# EAGLE schematic SGC.0 (EAGLE 7.0.0)
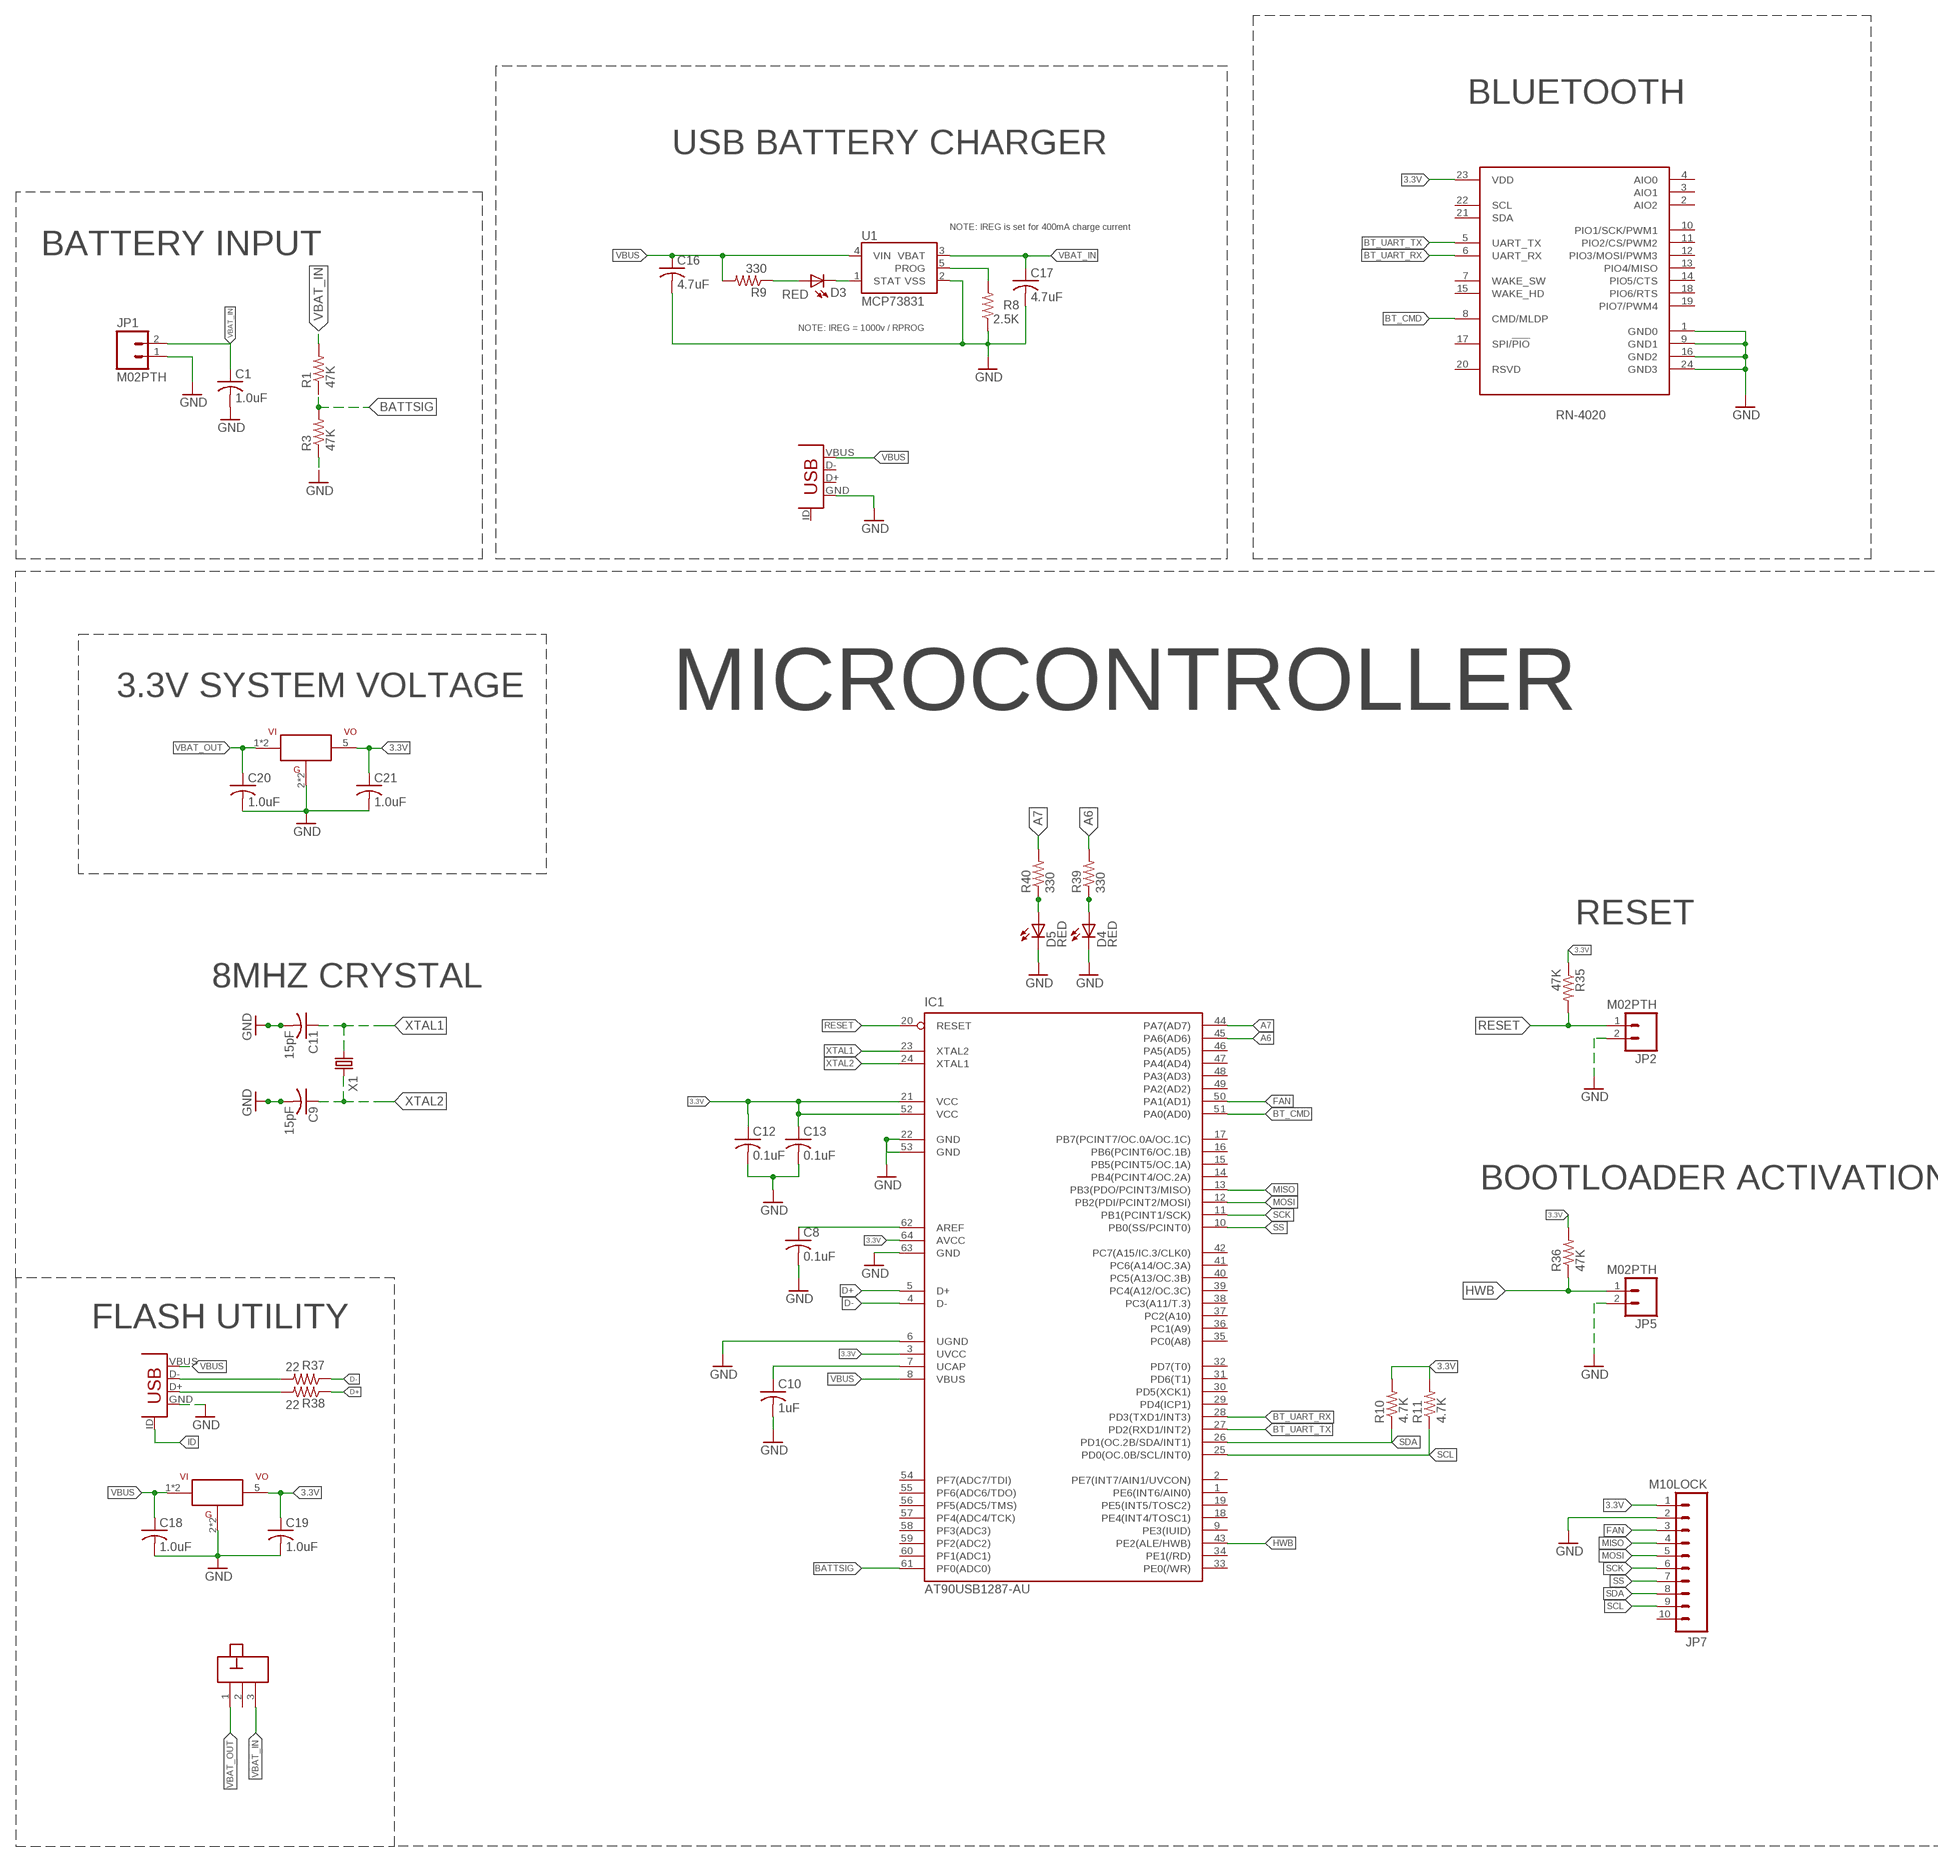
[diagram p0: schematic, sheet 1, part 1 of 2]
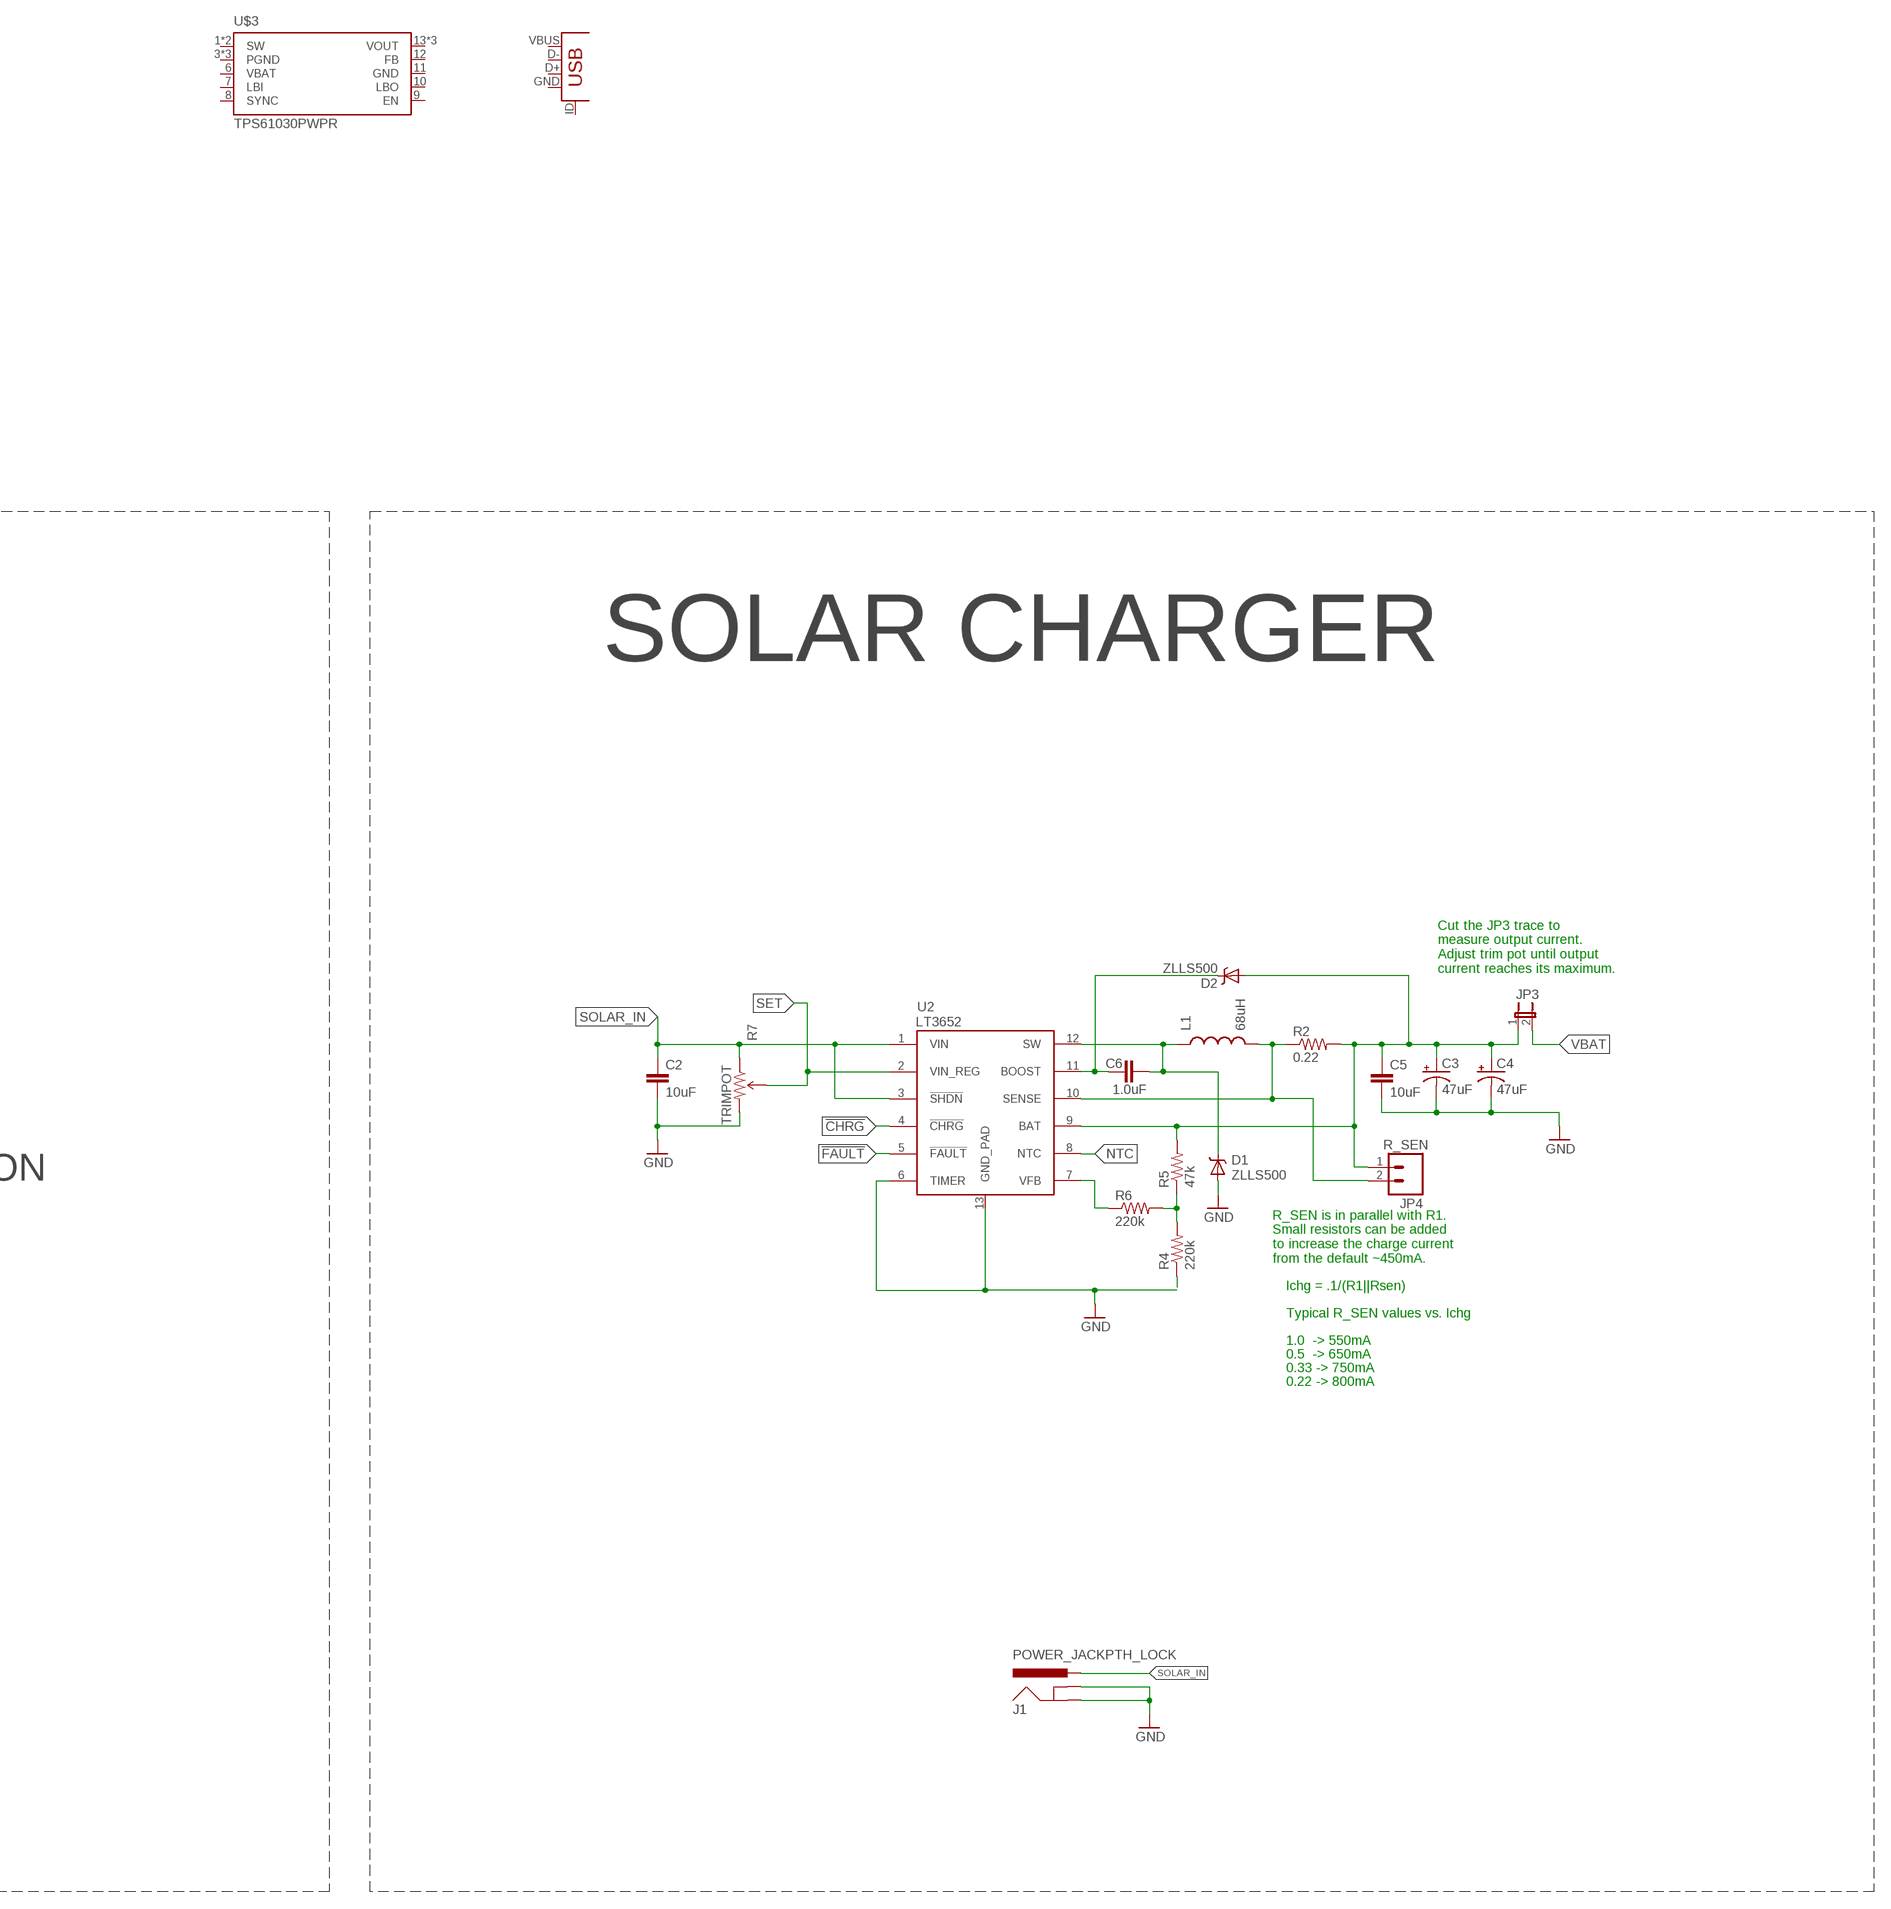
[diagram p1: schematic, sheet 1, part 2 of 2]

## Parts
C1  1.0uF  C-USC0603  [C0603]
C2  10uF  10UF50V20%(1210)  [1210]
C3  47uF  47UF-TANT  [EIA3528]
C4  47uF  47UF-TANT  [EIA3528]
C5  10uF  10UF-6.3V-20%(1206)  [1206]
C6  1.0uF  1.0UF-16V-10%(0603)  [0603-CAP]
C8  0.1uF  C-USC0603  [C0603]
C9  15pF  C-USC0603  [C0603]
C10  1uF  C-USC0603  [C0603]
C11  15pF  C-USC0603  [C0603]
C12  0.1uF  C-USC0603  [C0603]
C13  0.1uF  C-USC0603  [C0603]
C16  4.7uF  C-USC0603  [C0603]
C17  4.7uF  C-USC0603  [C0603]
C18  1.0uF  C-USC0603  [C0603]
C19  1.0uF  C-USC0603  [C0603]
C20  1.0uF  C-USC0603  [C0603]
C21  1.0uF  C-USC0603  [C0603]
D1  ZLLS500  ZLLS500ZLLS500  [SOT23]
D2  ZLLS500  ZLLS500ZLLS500  [SOT23]
D3  RED  LED0603  [LED-0603]
D4  RED  LED0603  [LED-0603]
D5  RED  LED0603  [LED-0603]
IC1  AT90USB1287-AU  [TQFP64]
J1  POWER_JACKPTH_LOCK  [POWER_JACK_PTH_LOCK]
JP1  M02PTH  [1X02]
JP2  M02PTH  [1X02]
JP3  JUMPER-PTH-2-NC  [PTH-JUMPER-NC_BOTTOM_NO_SILK]
JP4  R_SEN  M02PTH  [1X02]
JP5  M02PTH  [1X02]
JP7  M10LOCK  [1X10_LOCK]
L1  68uH  INDUCTOR68UH-1A  [CR75]
R1  47K  R-US_R0603  [R0603]
R2  0.22  0.22OHM1/4W1%(0805)  [0805]
R3  47K  R-US_R0603  [R0603]
R4  220k  220KOHM1/10W1%(0603)  [0603-RES]
R5  47k  47KOHM1/10W1%(0603)  [0603-RES]
R6  220k  220KOHM1/10W1%(0603)  [0603-RES]
R7  TRIMPOT  [TRIMPOT-5MM-V2]
R8  2.5K  R-US_R0603  [R0603]
R9  330  R-US_R0603  [R0603]
R10  4.7K  R-US_R0603  [R0603]
R11  4.7K  R-US_R0603  [R0603]
R35  47K  R-US_R0603  [R0603]
R36  47K  R-US_R0603  [R0603]
R37  22  R-US_R0603  [R0603]
R38  22  R-US_R0603  [R0603]
R39  330  R-US_R0603  [R0603]
R40  330  R-US_R0603  [R0603]
U1  MCP73831  [SOT23-5]
U2  LT3652  [MSOP-12_GND]
U$1  USB_MICRO_B_DX4  [USB_MICRO_B_DX4]
U$2  TPS73633-EP  [SOT23-5]
U$3  TPS61030PWPR  [TSSOP16]
U$4  TPS73633-EP  [SOT23-5]
U$5  USB_MICRO_B_DX4  [USB_MICRO_B_DX4]
U$6  RN4020  [RN4020]
U$7  SWITCH_SLIDE  [SWITCH_SLIDE]
U$8  USB_MICRO_B_DX4  [USB_MICRO_B_DX4]
X1  CRYSTALCTS406  [CTS406]

## Nets
3.3V: C12.1 C13.1 C19.1 C21.1 IC1.21(VCC) IC1.52(VCC) JP7.1 R10.2 R11.2 R35.1 R36.2 U$2.5 U$4.5 U$6.23(VDD)
!CHRG: U2.4(!CHRG)
!FAULT: U2.5(!FAULT)
A6: IC1.45(PA6(AD6)) R39.2
A7: IC1.44(PA7(AD7)) R40.2
BATTSIG: IC1.61(PF0(ADC0)) R1.1 R3.2
BOOST: C6.1 D2.3(C) U2.11(BOOST)
BT_CMD: IC1.51(PA0(AD0)) U$6.8(CMD/MLDP)
BT_UART_RX: IC1.28(PD3(TXD1/INT3)) U$6.6(UART_RX)
BT_UART_TX: IC1.27(PD2(RXD1/INT2)) U$6.5(UART_TX)
D+: IC1.5(D+) R37.1
D-: IC1.4(D-) R38.1
FAN: IC1.50(PA1(AD1)) JP7.3
FB: R4.2 R5.1 R6.2
GND: C1.2 C2.2 C3.C(-) C4.C(-) C5.2 C8.2 C9.2 C10.2 C11.2 C12.2 C13.2 C16.2 C17.2 C18.2 C19.2 C20.2 C21.2 D1.1(A) D4.C D5.C IC1.6(UGND) J1.GND J1.GNDBREAK JP1.1 JP2.2 JP5.2 JP7.2 R3.1 R4.1 R7.C(CW) R8.1 U1.2(VSS) U2.6(TIMER) U2.13(GND_PAD) U$1.GND U$2.2 U$2.4 U$4.2 U$4.4 U$5.GND U$6.1(GND0) U$6.9(GND1) U$6.16(GND2) U$6.24(GND3)
HWB: IC1.43(PE2(ALE/HWB)) JP5.1 R36.1
ID: U$1.ID
MISO: IC1.13(PB3(PDO/PCINT3/MISO)) JP7.4
MOSI: IC1.12(PB2(PDI/PCINT2/MOSI)) JP7.5
N$1: R37.2 U$1.D+
N$2: R38.2 U$1.D-
N$3: C10.1 IC1.7(UCAP)
N$4: R6.1 U2.7(VFB)
N$5: C3.A(+) C4.A(+) C5.1 D2.1(A) JP3.1 JP4.1 R2.2 R5.2 U2.9(BAT)
N$6: C8.1 IC1.62(AREF)
N$13: D3.A R9.1
N$14: D3.C U1.1(STAT)
N$15: R8.2 U1.5(PROG)
N$29: D4.A R39.1
N$31: D5.A R40.1
NTC: U2.8(NTC)
RESET: IC1.20(RESET) JP2.1 R35.2
SCK: IC1.11(PB1(PCINT1/SCK)) JP7.6
SCL: IC1.25(PD0(OC.0B/SCL/INT0)) JP7.9 R11.1
SDA: IC1.26(PD1(OC.2B/SDA/INT1)) JP7.8 R10.1
SENSE: JP4.2 L1.P$2 R2.1 U2.10(SENSE)
SET: R7.B(WIPER) U2.2(VIN_REG)
SOLAR_IN: C2.1 J1.PWR R7.A(CCW) U2.1(VIN) U2.3(!SHDN)
SS: IC1.10(PB0(SS/PCINT0)) JP7.7
SW: C6.2 D1.3(C) L1.P$1 U2.12(SW)
VBAT: JP3.2
VBAT_IN: C1.1 C17.1 JP1.2 R1.2 U1.3(VBAT) U$7.3
VBAT_OUT: C20.1 U$4.1 U$4.3 U$7.1
VBUS: C16.1 C18.1 R9.2 U1.4(VIN) U$1.VBUS U$2.1 U$2.3 U$5.VBUS
XTAL1: C11.1 IC1.23(XTAL2) X1.1
XTAL2: C9.1 IC1.24(XTAL1) X1.3
Unconnected: IC1.1(PE6(INT6/AIN0)) IC1.2(PE7(INT7/AIN1/UVCON)) IC1.9(PE3(IUID)) IC1.14(PB4(PCINT4/OC.2A)) IC1.15(PB5(PCINT5/OC.1A)) IC1.16(PB6(PCINT6/OC.1B)) IC1.17(PB7(PCINT7/OC.0A/OC.1C)) IC1.18(PE4(INT4/TOSC1)) IC1.19(PE5(INT5/TOSC2)) IC1.29(PD4(ICP1)) IC1.30(PD5(XCK1)) IC1.31(PD6(T1)) IC1.32(PD7(T0)) IC1.33(PE0(/WR)) IC1.34(PE1(/RD)) IC1.35(PC0(A8)) IC1.36(PC1(A9)) IC1.37(PC2(A10)) IC1.38(PC3(A11/T.3)) IC1.39(PC4(A12/OC.3C)) IC1.40(PC5(A13/OC.3B)) IC1.41(PC6(A14/OC.3A)) IC1.42(PC7(A15/IC.3/CLK0)) IC1.46(PA5(AD5)) IC1.47(PA4(AD4)) IC1.48(PA3(AD3)) IC1.49(PA2(AD2)) IC1.54(PF7(ADC7/TDI)) IC1.55(PF6(ADC6/TDO)) IC1.56(PF5(ADC5/TMS)) IC1.57(PF4(ADC4/TCK)) IC1.58(PF3(ADC3)) IC1.59(PF2(ADC2)) IC1.60(PF1(ADC1)) IC1.64(AVCC) JP7.10 U$3.1(SW) U$3.2(SW) U$3.3(PGND) U$3.4(PGND) U$3.5(PGND) U$3.8(SYNC) U$3.9(EN) U$3.10(LBO) U$3.11(GND) U$3.12(FB) U$3.13(VOUT) U$3.14(VOUT) U$3.15(VOUT) U$5.D+ U$5.D- U$5.ID U$6.2(AIO2) U$6.3(AIO1) U$6.4(AIO0) U$6.7(WAKE_SW) U$6.10(PIO1/SCK/PWM1) U$6.11(PIO2/CS/PWM2) U$6.12(PIO3/MOSI/PWM3) U$6.13(PIO4/MISO) U$6.14(PIO5/CTS) U$6.15(WAKE_HD) U$6.17(SPI/!PIO) U$6.18(PIO6/RTS) U$6.19(PIO7/PWM4) U$6.20(RSVD) U$6.21(SDA) U$6.22(SCL) U$7.2 U$8.D+ U$8.D- U$8.GND U$8.ID U$8.VBUS

## Notes on the sheet
- BLUETOOTH
- USB BATTERY CHARGER
- NOTE: IREG is set for 400mA charge current
- BATTERY INPUT
- NOTE: IREG = 1000v / RPROG
- 3.3V SYSTEM VOLTAGE
- MICROCONTROLLER | SOLAR CHARGER
- RESET
- 8MHZ CRYSTAL
- Cut the JP3 trace to
  measure output current.
  Adjust trim pot until output
  current reaches its maximum.
- BOOTLOADER ACTIVATION
- R_SEN is in parallel with R1.
  Small resistors can be added
  to increase the charge current
  from the default ~450mA.
- Ichg = .1/(R1||Rsen)
- Typical R_SEN values vs. Ichg
- FLASH UTILITY
- 1.0  -> 550mA
- 0.5  -> 650mA
- 0.33 -> 750mA
- 0.22 -> 800mA

## Power pins joined to a net without a drawn wire
GND: IC1.22(GND) IC1.53(GND) IC1.63(GND)
LBI: U$3.7(LBI)
UVCC: IC1.3(UVCC)
VBAT: U$3.6(VBAT)
VBUS: IC1.8(VBUS)

## Library data of the parts
C1 C16-C21 = SGC:C-US: CAPACITOR, American symbol
C2 = SparkFun-Capacitors:10UF50V20%(1210): CAP-09824; PROD_ID: CAP-09824
C3 C4 = SparkFun-Capacitors:47UF-TANT: 47uF Tantalum SMT CAP-08310- 10V 10% (EIA-3528); PROD_ID: CAP-08310
C5 = SparkFun-Capacitors:10UF-6.3V-20%(1206): CAP-10057 Ceramic; PROD_ID: CAP-10057
C6 = SparkFun-Capacitors:1.0UF-16V-10%(0603): CAP-00868; PROD_ID: CAP-00868
C8 C12 C13 = SGC:C-US: CAPACITOR, American symbol; MPN: 0603YC104KAZ2A; OC_NEWARK: 10R5927
C9 C11 = SGC:C-US: CAPACITOR, American symbol; MPN: 0201ZC103KAT2A; OC_NEWARK: 10R5904
C10 = SGC:C-US: CAPACITOR, American symbol; MPN: C0603C302J5GACTU; OC_NEWARK: 29T9014
D1 D2 = SparkFun-DiscreteSemi:ZLLS500: 700mA 40V SOT-23 Schottky; PROD_ID: DIO-08411
D3-D5 = SGC:LED: LEDs Standard schematic elements and footprints for 5mm, 3mm, 1206, and 0603 sized LEDs. 5mm - Spark Fun Electronics SKU : COM-00529 (and others); OC_NEWARK: unknown
IC1 = SGC:AT90USB1287-*: Atmel AT90USB1287 AVR Microcontroller with USB Interface and 128kB Flash Memory
J1 = SGC:POWER_JACK: Power Jack This is the standard 5.5mm barrel jack for power. The PTH is the most common, proven, reliable, footprint. The Slot footprint only works if the mill layer is transmitted to the PCB fab house so be warned. Mating wall wart : TOL-00298 (and others); PROD_ID: PRT-00119
JP1 JP2 JP5 = SGC:M02: Standard 2-pin 0.1" header. Use with - straight break away headers ( PRT-00116) - right angle break away headers (PRT-00553) - swiss pins (PRT-00743) - machine pins (PRT-00117) - female headers (PRT-00115) Molex polarized connector foot print use with: PRT-08233 with associated crimp pins and housings. 2.54_SCREWTERM for use with PRT-10571. 3.5mm Screw Terminal footprints for PRT-08084 5mm Screw Terminal footprints for use with PRT-08433
JP3 = SparkFun-Passives:JUMPER-PTH-2-NC
JP4 = SparkFun-Connectors:M02: Standard 2-pin 0.1" header. Use with - straight break away headers ( PRT-00116) - right angle break away headers (PRT-00553) - swiss pins (PRT-00743) - machine pins (PRT-00117) - female headers (PRT-00115) Molex polarized connector foot print use with: PRT-08233 with associated crimp pins and housings. 2.54_SCREWTERM for use with PRT-10571. 3.5mm Screw Terminal footprints for PRT-08084 5mm Screw Terminal footprints for use with PRT-08433
JP7 = SGC:M10: Header 10 Standard 10-pin 0.1" header. Use with straight break away headers (SKU : PRT-00116), right angle break away headers (PRT-00553), swiss pins (PRT-00743), machine pins (PRT-00117), and female headers (PRT-00115).
L1 = SGC:INDUCTOR: Inductors Basic Inductor/Choke - 0603 and 1206. Footprints are not proven and vary greatly between part numbers. SRN6045- 33uH, 20% 1.4A SDR0403-560KL - 56uH, 10%, 500mA RMS/740mA peak; PROD_ID: NDUC-09739
R1 R3 R10 R11 R35 R36 = SGC:R-US_: RESISTOR, American symbol; OC_NEWARK: unknown
R2 = SparkFun-Resistors:0.22OHM1/4W1%(0805): RES-09883; PROD_ID: RES-09883
R4 R6 = SparkFun-Resistors:220KOHM1/10W1%(0603): RES-08969; PROD_ID: RES-08969
R5 = SparkFun-Resistors:47KOHM1/10W1%(0603): RES-07871; PROD_ID: RES-07871; VALUE: 47K
R7 = SparkFun-Electromechanical:TRIMPOT: Various small potentiometers for "set-and-forget" applications
R8 R9 = SGC:R-US_: RESISTOR, American symbol
R37 R38 = SGC:R-US_: RESISTOR, American symbol; MF: VISHAY/DALE; MPN: CRCW06034K70FKEA; OC_NEWARK: 52K8494
R39 R40 = SGC:R-US_: RESISTOR, American symbol; MF: BOURNS, INC.; MPN: CR0603FX3300ELF; OC_NEWARK: 01J3145
U1 = SGC:MCP73831: Miniature single cell, fully integrated Li-Ion, Li-polymer charge management controller http://ww1.microchip.com/downloads/en/DeviceDoc/21984a.pdf IC-09995; PROD_ID: IC-09995
U2 = SparkFun-PowerIC:LT3652: LT3652 MPPT Solar Charge Controller 5V-32V smart charger for batteries up to 14.4V
U$1 U$5 U$8 = SGC:USB_MICRO_B_DX4
U$2 U$4 = SGC:TPS73633-EP
U$3 = SGC:TPS61030PWPR
U$6 = SGC:RN4020
U$7 = SGC:SWITCH_SLIDE
X1 = SGC:CRYSTAL: CRYSTAL; OC_FARNELL: unknown; OC_NEWARK: unknown